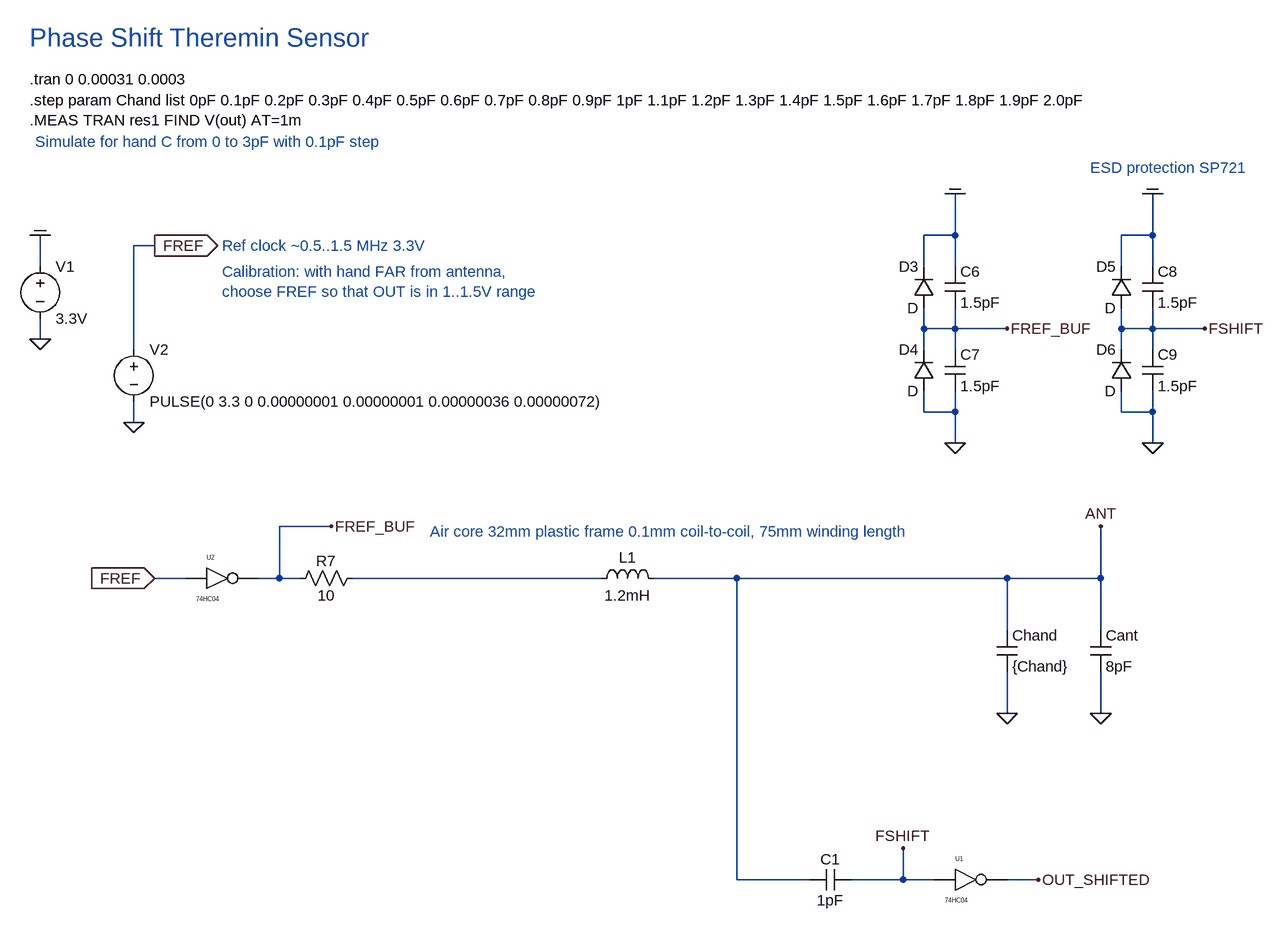
[diagram p0: schematic phase_shift_sensor_v4_optimization_1200uH.asc]
phase_shift_sensor_v4_optimization_1200uH.asc, the LTspice schematic file:
Version 4
SHEET 1 3724 1652
WIRE 1456 -64 1456 -128
WIRE 1456 -64 1408 -64
WIRE 1760 -64 1760 -128
WIRE 1760 -64 1712 -64
WIRE 224 -48 192 -48
WIRE 48 -16 48 -64
WIRE 1408 -16 1408 -64
WIRE 1456 -16 1456 -64
WIRE 1712 -16 1712 -64
WIRE 1760 -16 1760 -64
WIRE 1408 80 1408 48
WIRE 1456 80 1456 48
WIRE 1456 80 1408 80
WIRE 1536 80 1456 80
WIRE 1712 80 1712 48
WIRE 1760 80 1760 48
WIRE 1760 80 1712 80
WIRE 1840 80 1760 80
WIRE 48 96 48 64
WIRE 192 112 192 -48
WIRE 1408 112 1408 80
WIRE 1456 112 1456 80
WIRE 1712 112 1712 80
WIRE 1760 112 1760 80
WIRE 1408 208 1408 176
WIRE 1456 208 1456 176
WIRE 1456 208 1408 208
WIRE 1712 208 1712 176
WIRE 1760 208 1760 176
WIRE 1760 208 1712 208
WIRE 192 224 192 192
WIRE 1456 256 1456 208
WIRE 1760 256 1760 208
WIRE 496 384 416 384
WIRE 272 464 224 464
WIRE 416 464 416 384
WIRE 416 464 384 464
WIRE 448 464 416 464
WIRE 912 464 528 464
WIRE 1120 464 992 464
WIRE 1536 464 1120 464
WIRE 1680 464 1680 384
WIRE 1680 464 1536 464
WIRE 1536 544 1536 464
WIRE 1680 544 1680 464
WIRE 1536 672 1536 608
WIRE 1680 672 1680 608
WIRE 1120 928 1120 464
WIRE 1232 928 1120 928
WIRE 1376 928 1376 880
WIRE 1376 928 1296 928
WIRE 1424 928 1376 928
WIRE 1584 928 1536 928
FLAG 48 96 0
FLAG 224 -48 FREF
IOPIN 224 -48 Out
FLAG 192 224 0
FLAG 1680 384 ANT
FLAG 1680 672 0
FLAG 1536 672 0
FLAG 48 -64 COM
FLAG 1456 256 0
FLAG 1456 -128 COM
FLAG 1760 256 0
FLAG 1760 -128 COM
FLAG 1376 880 FSHIFT
FLAG 1584 928 OUT_SHIFTED
FLAG 1840 80 FSHIFT
FLAG 224 464 FREF
IOPIN 224 464 In
FLAG 1536 80 FREF_BUF
FLAG 496 384 FREF_BUF
SYMBOL voltage 48 -32 R0
WINDOW 123 0 0 Left 2
WINDOW 39 0 0 Left 2
SYMATTR InstName V1
SYMATTR Value 3.3V
SYMBOL voltage 192 96 R0
WINDOW 123 0 0 Left 2
WINDOW 39 0 0 Left 2
SYMATTR InstName V2
SYMATTR Value PULSE(0 3.3 0 0.00000001 0.00000001 0.00000036 0.00000072)
SYMBOL ind 896 480 R270
WINDOW 0 32 56 VTop 2
WINDOW 3 5 56 VBottom 2
SYMATTR InstName L1
SYMATTR Value 1.2mH
SYMATTR SpiceLine Ipk=0.01 Rser=24.4 Rpar=1.779Meg Cpar=1.343pF
SYMBOL cap 1664 544 R0
SYMATTR InstName Cant
SYMATTR Value 8pF
SYMBOL cap 1520 544 R0
SYMATTR InstName Chand
SYMATTR Value {Chand}
SYMBOL diode 1424 48 R180
WINDOW 0 24 64 Left 2
WINDOW 3 24 0 Left 2
SYMATTR InstName D3
SYMBOL diode 1424 176 R180
WINDOW 0 24 64 Left 2
WINDOW 3 24 0 Left 2
SYMATTR InstName D4
SYMBOL cap 1440 -16 R0
SYMATTR InstName C6
SYMATTR Value 1.5pF
SYMBOL cap 1440 112 R0
SYMATTR InstName C7
SYMATTR Value 1.5pF
SYMBOL diode 1728 48 R180
WINDOW 0 24 64 Left 2
WINDOW 3 24 0 Left 2
SYMATTR InstName D5
SYMBOL diode 1728 176 R180
WINDOW 0 24 64 Left 2
WINDOW 3 24 0 Left 2
SYMATTR InstName D6
SYMBOL cap 1744 -16 R0
SYMATTR InstName C8
SYMATTR Value 1.5pF
SYMBOL cap 1744 112 R0
SYMATTR InstName C9
SYMATTR Value 1.5pF
SYMBOL cap 1296 912 R90
WINDOW 0 0 32 VBottom 2
WINDOW 3 32 32 VTop 2
SYMATTR InstName C1
SYMATTR Value 1pF
SYMBOL EXTRA\\74HC\\74hc04 1472 864 R0
SYMATTR InstName U1
SYMATTR SpiceLine VCC=3.3  SPEED=1.0  TRIPDT=1e-9
SYMBOL EXTRA\\74HC\\74hc04 320 400 R0
SYMATTR InstName U2
SYMATTR SpiceLine VCC=3.3  SPEED=1.0  TRIPDT=1e-9
SYMBOL res 544 448 R90
WINDOW 0 5 56 VBottom 2
WINDOW 3 27 56 VTop 2
SYMATTR InstName R7
SYMATTR Value 10
TEXT 32 -304 Left 2 !.tran 0 0.00031 0.0003
TEXT 32 -272 Left 2 !.step param Chand list 0pF 0.1pF 0.2pF 0.3pF 0.4pF 0.5pF 0.6pF 0.7pF 0.8pF 0.9pF 1pF 1.1pF 1.2pF 1.3pF 1.4pF 1.5pF 1.6pF 1.7pF 1.8pF 1.9pF 2.0pF\n.MEAS TRAN res1 FIND V(out) AT=1m
TEXT 328 -48 Left 2 ;Ref clock ~0.5..1.5 MHz 3.3V
TEXT 32 -368 Left 4 ;Phase Shift Theremin Sensor
TEXT 648 392 Left 2 ;Air core 32mm plastic frame 0.1mm coil-to-coil, 75mm winding length
TEXT 1664 -168 Left 2 ;ESD protection SP721
TEXT 328 -8 Left 2 ;Calibration: with hand FAR from antenna,\nchoose FREF so that OUT is in 1..1.5V range
TEXT 40 -208 Left 2 ;Simulate for hand C from 0 to 3pF with 0.1pF step

The netlist it stands for:
* phase_shift_sensor_v4_optimization_1200uH.asc
V1 COM 0 3.3V
V2 FREF 0 PULSE(0 3.3 0 0.00000001 0.00000001 0.00000036 0.00000072)
L1 N001 ANT 1.2mH Ipk=0.01 Rser=24.4 Rpar=1.779Meg Cpar=1.343pF
Cant ANT 0 8pF
Chand ANT 0 {Chand}
D3 FREF_BUF COM D
D4 0 FREF_BUF D
C6 COM FREF_BUF 1.5pF
C7 FREF_BUF 0 1.5pF
D5 FSHIFT COM D
D6 0 FSHIFT D
C8 COM FSHIFT 1.5pF
C9 FSHIFT 0 1.5pF
C1 FSHIFT ANT 1pF
XU1 FSHIFT OUT_SHIFTED VCC 0 74HC04 VCC=3.3  SPEED=1.0  TRIPDT=1e-9  ; pins A Y
XU2 FREF FREF_BUF VCC 0 74HC04 VCC=3.3  SPEED=1.0  TRIPDT=1e-9  ; pins A Y
R7 N001 FREF_BUF 10
.model D D
.lib standard.dio
.tran 0 0.00031 0.0003
.step param Chand list 0pF 0.1pF 0.2pF 0.3pF 0.4pF 0.5pF 0.6pF 0.7pF 0.8pF 0.9pF 1pF 1.1pF 1.2pF 1.3pF 1.4pF 1.5pF 1.6pF 1.7pF 1.8pF 1.9pF 2.0pF
.MEAS TRAN res1 FIND V(out) AT=1m
* Ref clock ~0.5..1.5 MHz 3.3V
* Phase Shift Theremin Sensor
* Air core 32mm plastic frame 0.1mm coil-to-coil, 75mm winding length
* ESD protection SP721
* Calibration: with hand FAR from antenna,
* choose FREF so that OUT is in 1..1.5V range
* Simulate for hand C from 0 to 3pF with 0.1pF step
.lib 74HC.lib
.backanno
.end